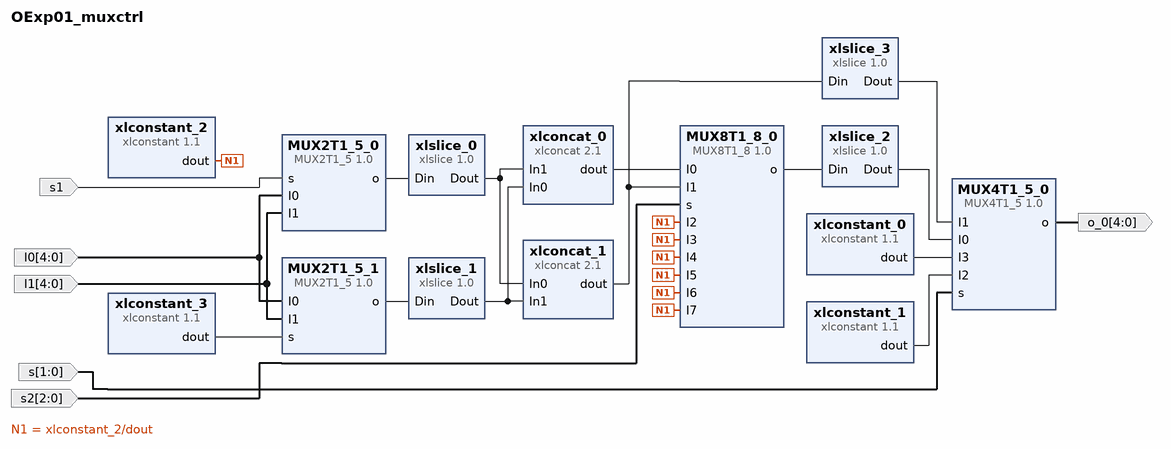
[diagram p0: block diagram of the top level]
# Vivado block design OExp01_muxctrl, xc7k160tfbg676-2L, Vivado 2022.2
create_bd_design OExp01_muxctrl

create_bd_port -dir I s1
create_bd_port -dir I -from 4 -to 0 I0
create_bd_port -dir I -from 4 -to 0 I1
create_bd_port -dir I -from 1 -to 0 s
create_bd_port -dir I -from 2 -to 0 s2
create_bd_port -dir O -from 4 -to 0 o_0

create_bd_cell -type ip -vlnv xilinx.com:user:MUX2T1_5:1.0 MUX2T1_5_0
create_bd_cell -type ip -vlnv xilinx.com:user:MUX2T1_5:1.0 MUX2T1_5_1
create_bd_cell -type ip -vlnv xilinx.com:user:MUX4T1_5:1.0 MUX4T1_5_0
create_bd_cell -type ip -vlnv xilinx.com:ip:xlslice:1.0 xlslice_0
set_property -dict {CONFIG.DIN_FROM 3 CONFIG.DIN_WIDTH 5} [get_bd_cells xlslice_0]
create_bd_cell -type ip -vlnv xilinx.com:ip:xlslice:1.0 xlslice_1
set_property -dict {CONFIG.DIN_FROM 3 CONFIG.DIN_WIDTH 5} [get_bd_cells xlslice_1]
create_bd_cell -type ip -vlnv xilinx.com:ip:xlconcat:2.1 xlconcat_0
set_property -dict {CONFIG.IN0_WIDTH 4 CONFIG.IN1_WIDTH 4} [get_bd_cells xlconcat_0]
create_bd_cell -type ip -vlnv xilinx.com:ip:xlconcat:2.1 xlconcat_1
set_property -dict {CONFIG.IN0_WIDTH 4 CONFIG.IN1_WIDTH 4} [get_bd_cells xlconcat_1]
create_bd_cell -type ip -vlnv xilinx.com:ip:xlconstant:1.1 xlconstant_0
set_property -dict {CONFIG.CONST_VAL 0 CONFIG.CONST_WIDTH 5} [get_bd_cells xlconstant_0]
create_bd_cell -type ip -vlnv xilinx.com:ip:xlconstant:1.1 xlconstant_1
set_property -dict {CONFIG.CONST_VAL 1 CONFIG.CONST_WIDTH 5} [get_bd_cells xlconstant_1]
create_bd_cell -type ip -vlnv xilinx.com:ip:xlconstant:1.1 xlconstant_2
set_property -dict {CONFIG.CONST_VAL 1 CONFIG.CONST_WIDTH 8} [get_bd_cells xlconstant_2]
create_bd_cell -type ip -vlnv xilinx.com:ip:xlconstant:1.1 xlconstant_3
set_property -dict {CONFIG.CONST_VAL 1 CONFIG.CONST_WIDTH 1} [get_bd_cells xlconstant_3]
create_bd_cell -type ip -vlnv xilinx.com:ip:xlslice:1.0 xlslice_2
set_property -dict {CONFIG.DIN_FROM 4 CONFIG.DIN_WIDTH 8} [get_bd_cells xlslice_2]
create_bd_cell -type ip -vlnv xilinx.com:ip:xlslice:1.0 xlslice_3
set_property -dict {CONFIG.DIN_FROM 4 CONFIG.DIN_WIDTH 8} [get_bd_cells xlslice_3]
create_bd_cell -type ip -vlnv xilinx.com:user:MUX8T1_8:1.0 MUX8T1_8_0

# ---- connections ----

connect_bd_net -net I0_0_1 [get_bd_ports I0] [get_bd_pins MUX2T1_5_0/I0] [get_bd_pins MUX2T1_5_1/I0]
connect_bd_net [get_bd_ports I1] [get_bd_pins MUX2T1_5_0/I1] [get_bd_pins MUX2T1_5_1/I1]
connect_bd_net [get_bd_pins MUX2T1_5_0/o] [get_bd_pins xlslice_0/Din]
connect_bd_net [get_bd_pins MUX2T1_5_1/o] [get_bd_pins xlslice_1/Din]
connect_bd_net [get_bd_pins MUX4T1_5_0/o] [get_bd_ports o_0]
connect_bd_net [get_bd_pins MUX8T1_8_0/o] [get_bd_pins xlslice_2/Din]
connect_bd_net -net s_0_1 [get_bd_ports s1] [get_bd_pins MUX2T1_5_0/s]
connect_bd_net -net s_0_2 [get_bd_ports s] [get_bd_pins MUX4T1_5_0/s]
connect_bd_net -net s_0_3 [get_bd_ports s2] [get_bd_pins MUX8T1_8_0/s]
connect_bd_net [get_bd_pins xlconcat_0/dout] [get_bd_pins MUX8T1_8_0/I0]
connect_bd_net [get_bd_pins xlconcat_1/dout] [get_bd_pins MUX8T1_8_0/I1] [get_bd_pins xlslice_3/Din]
connect_bd_net [get_bd_pins xlconstant_0/dout] [get_bd_pins MUX4T1_5_0/I3]
connect_bd_net [get_bd_pins xlconstant_1/dout] [get_bd_pins MUX4T1_5_0/I2]
connect_bd_net [get_bd_pins xlconstant_2/dout] \
  [get_bd_pins MUX8T1_8_0/I2] [get_bd_pins MUX8T1_8_0/I3] [get_bd_pins MUX8T1_8_0/I4] [get_bd_pins MUX8T1_8_0/I5] \
  [get_bd_pins MUX8T1_8_0/I6] [get_bd_pins MUX8T1_8_0/I7]
connect_bd_net [get_bd_pins xlconstant_3/dout] [get_bd_pins MUX2T1_5_1/s]
connect_bd_net [get_bd_pins xlslice_0/Dout] [get_bd_pins xlconcat_0/In1] [get_bd_pins xlconcat_1/In0]
connect_bd_net [get_bd_pins xlslice_1/Dout] [get_bd_pins xlconcat_1/In1] [get_bd_pins xlconcat_0/In0]
connect_bd_net [get_bd_pins xlslice_2/Dout] [get_bd_pins MUX4T1_5_0/I0]
connect_bd_net [get_bd_pins xlslice_3/Dout] [get_bd_pins MUX4T1_5_0/I1]

validate_bd_design
save_bd_design
